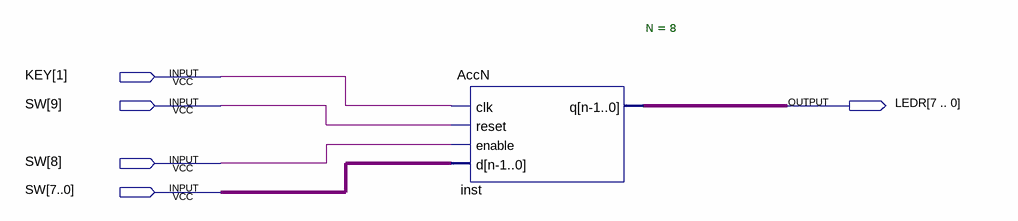
[diagram p0: schematic sheet]
// Quartus schematic AccN_Demo.bdf as structural Verilog: 1 symbols, 5 pins
module AccN_Demo (
  input  [1:1] KEY,
  input  [9:0] SW,
  output [7:0] LEDR
);

  AccN #(.N(8)) inst (.clk(KEY[1]), .reset(SW[9]), .enable(SW[8]), .d(SW[7:0]), .q(LEDR));
endmodule
